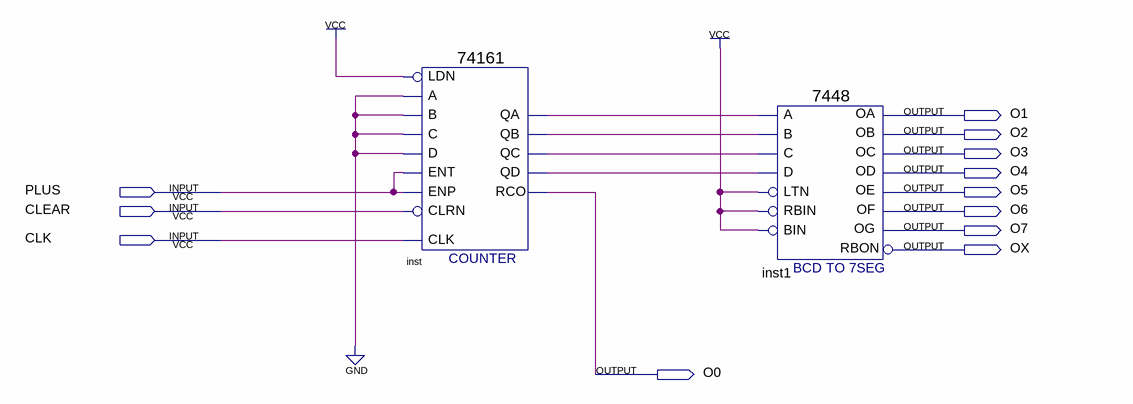
[diagram p0: schematic sheet]
// Quartus schematic exp6.bdf as structural Verilog: 2 symbols, 12 pins
module exp6 (
  input  PLUS,
  input  CLEAR,
  input  CLK,
  output O1,
  output O2,
  output O3,
  output O4,
  output O5,
  output O6,
  output O7,
  output OX,
  output O0
);

  wire inst_qa, inst_qb, inst_qc, inst_qd;

  \74161  inst (
    .CLRN(CLEAR), .CLK(CLK), .ENP(PLUS), .LDN(1'b1), .A(1'b0), .D(1'b0), .ENT(PLUS), .B(1'b0), .C(1'b0),
    .QD(inst_qd), .QC(inst_qc), .QB(inst_qb), .QA(inst_qa), .RCO(O0));
  \7448  inst1 (
    .A(inst_qa), .C(inst_qc), .D(inst_qd), .B(inst_qb), .RBIN(1'b1), .BIN(1'b1), .LTN(1'b1), .OC(O3),
    .OE(O5), .OD(O4), .OF(O6), .OG(O7), .OB(O2), .OA(O1), .RBON(OX));
endmodule
